# EAGLE schematic Respeaker Microphone Array v1.0 (EAGLE 7.3.0)
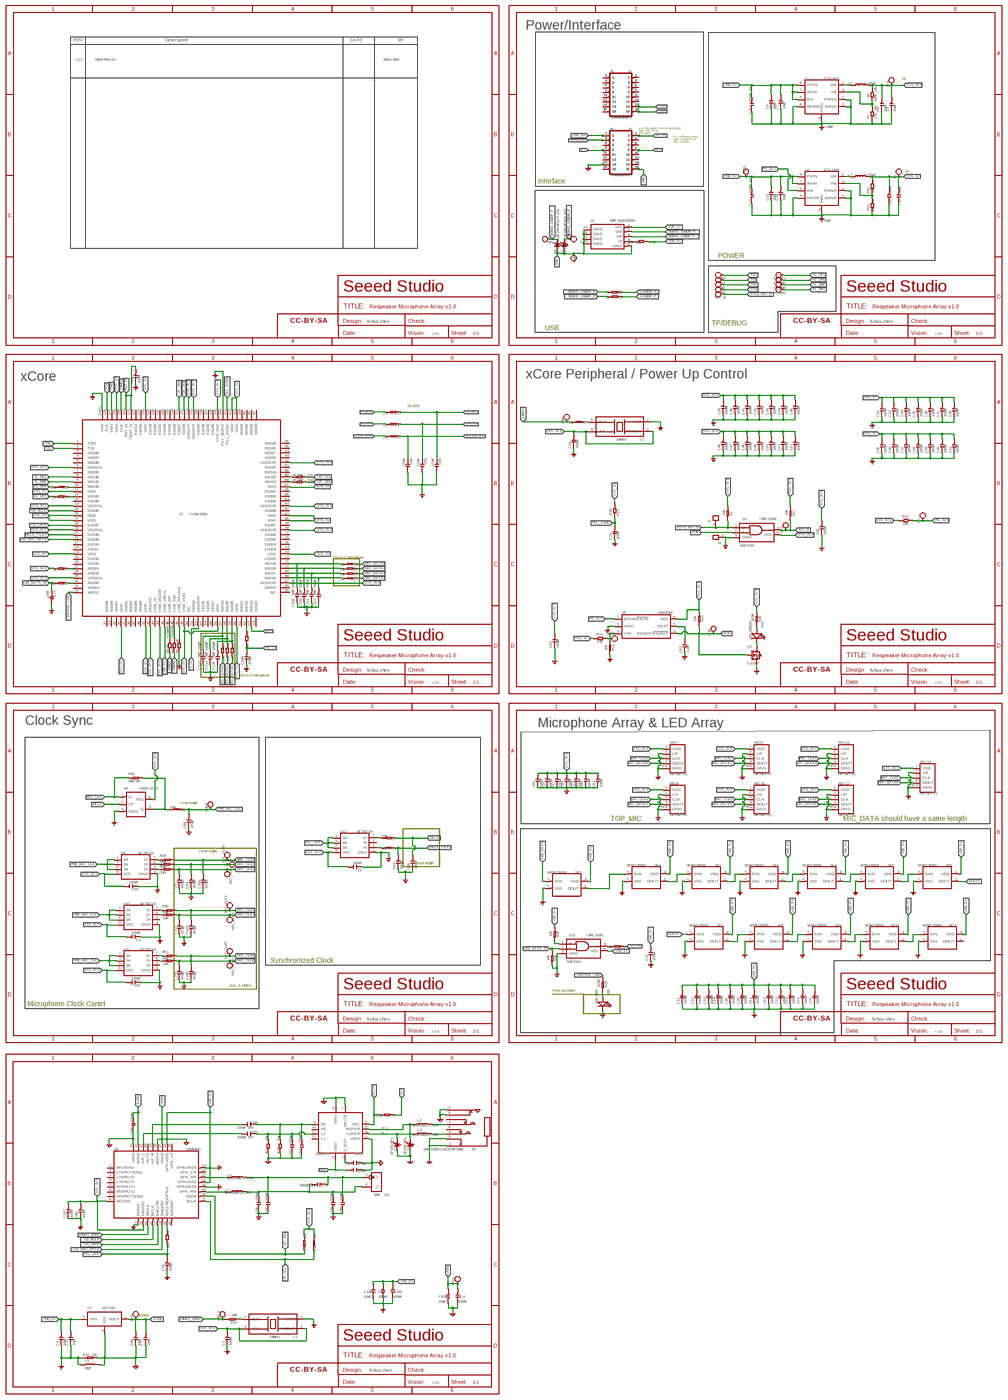
[diagram p0: schematic, sheet 1, overview]
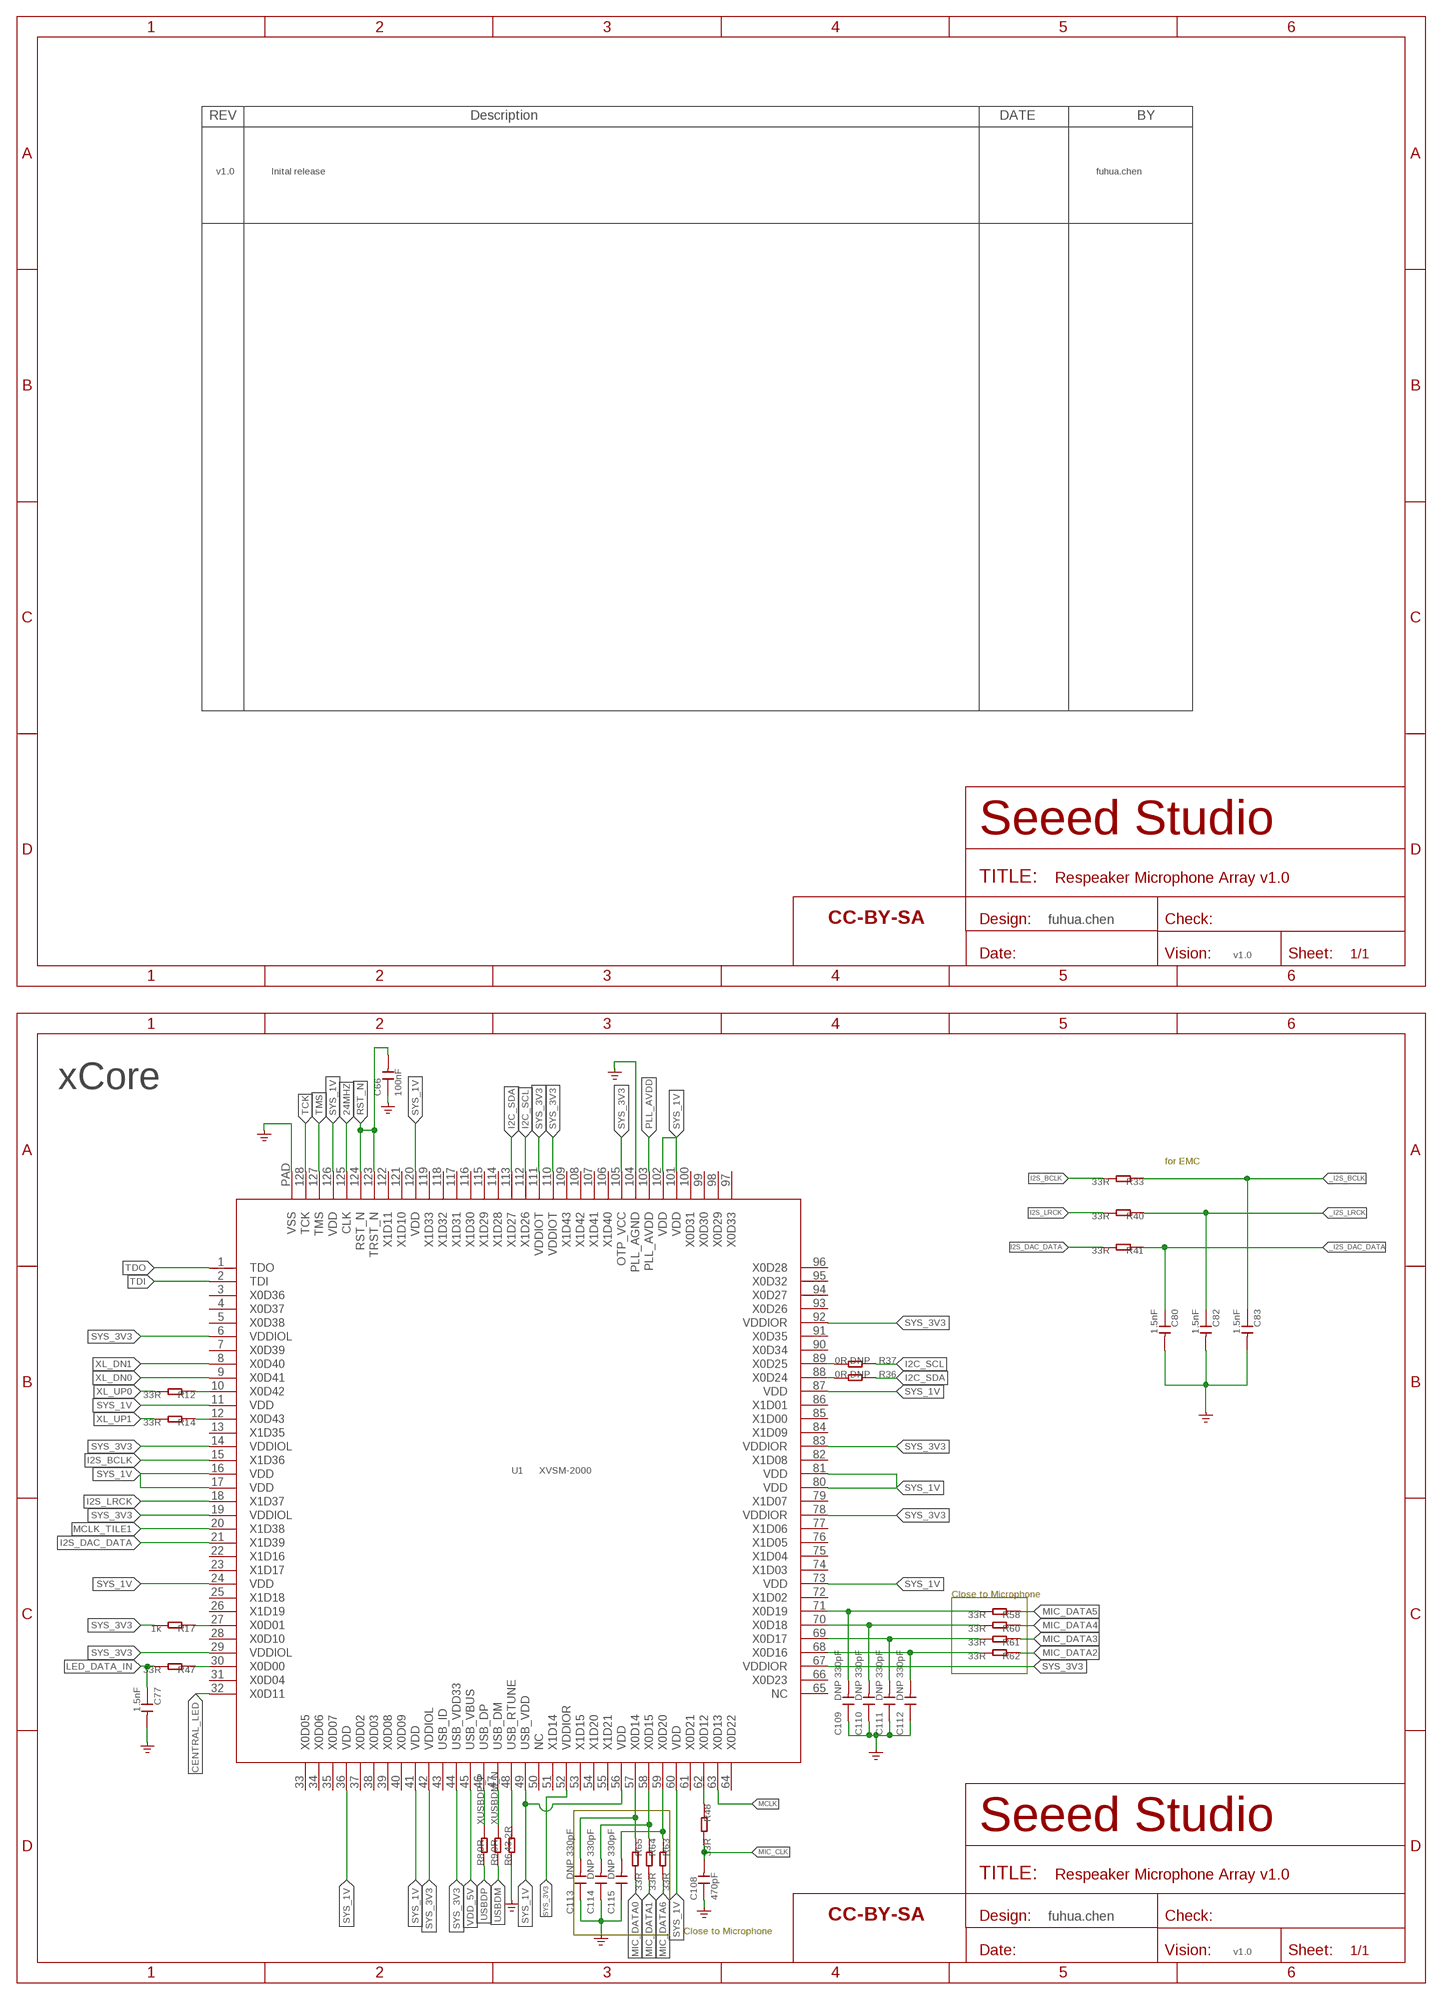
[diagram p1: schematic, sheet 1, part 1 of 4]
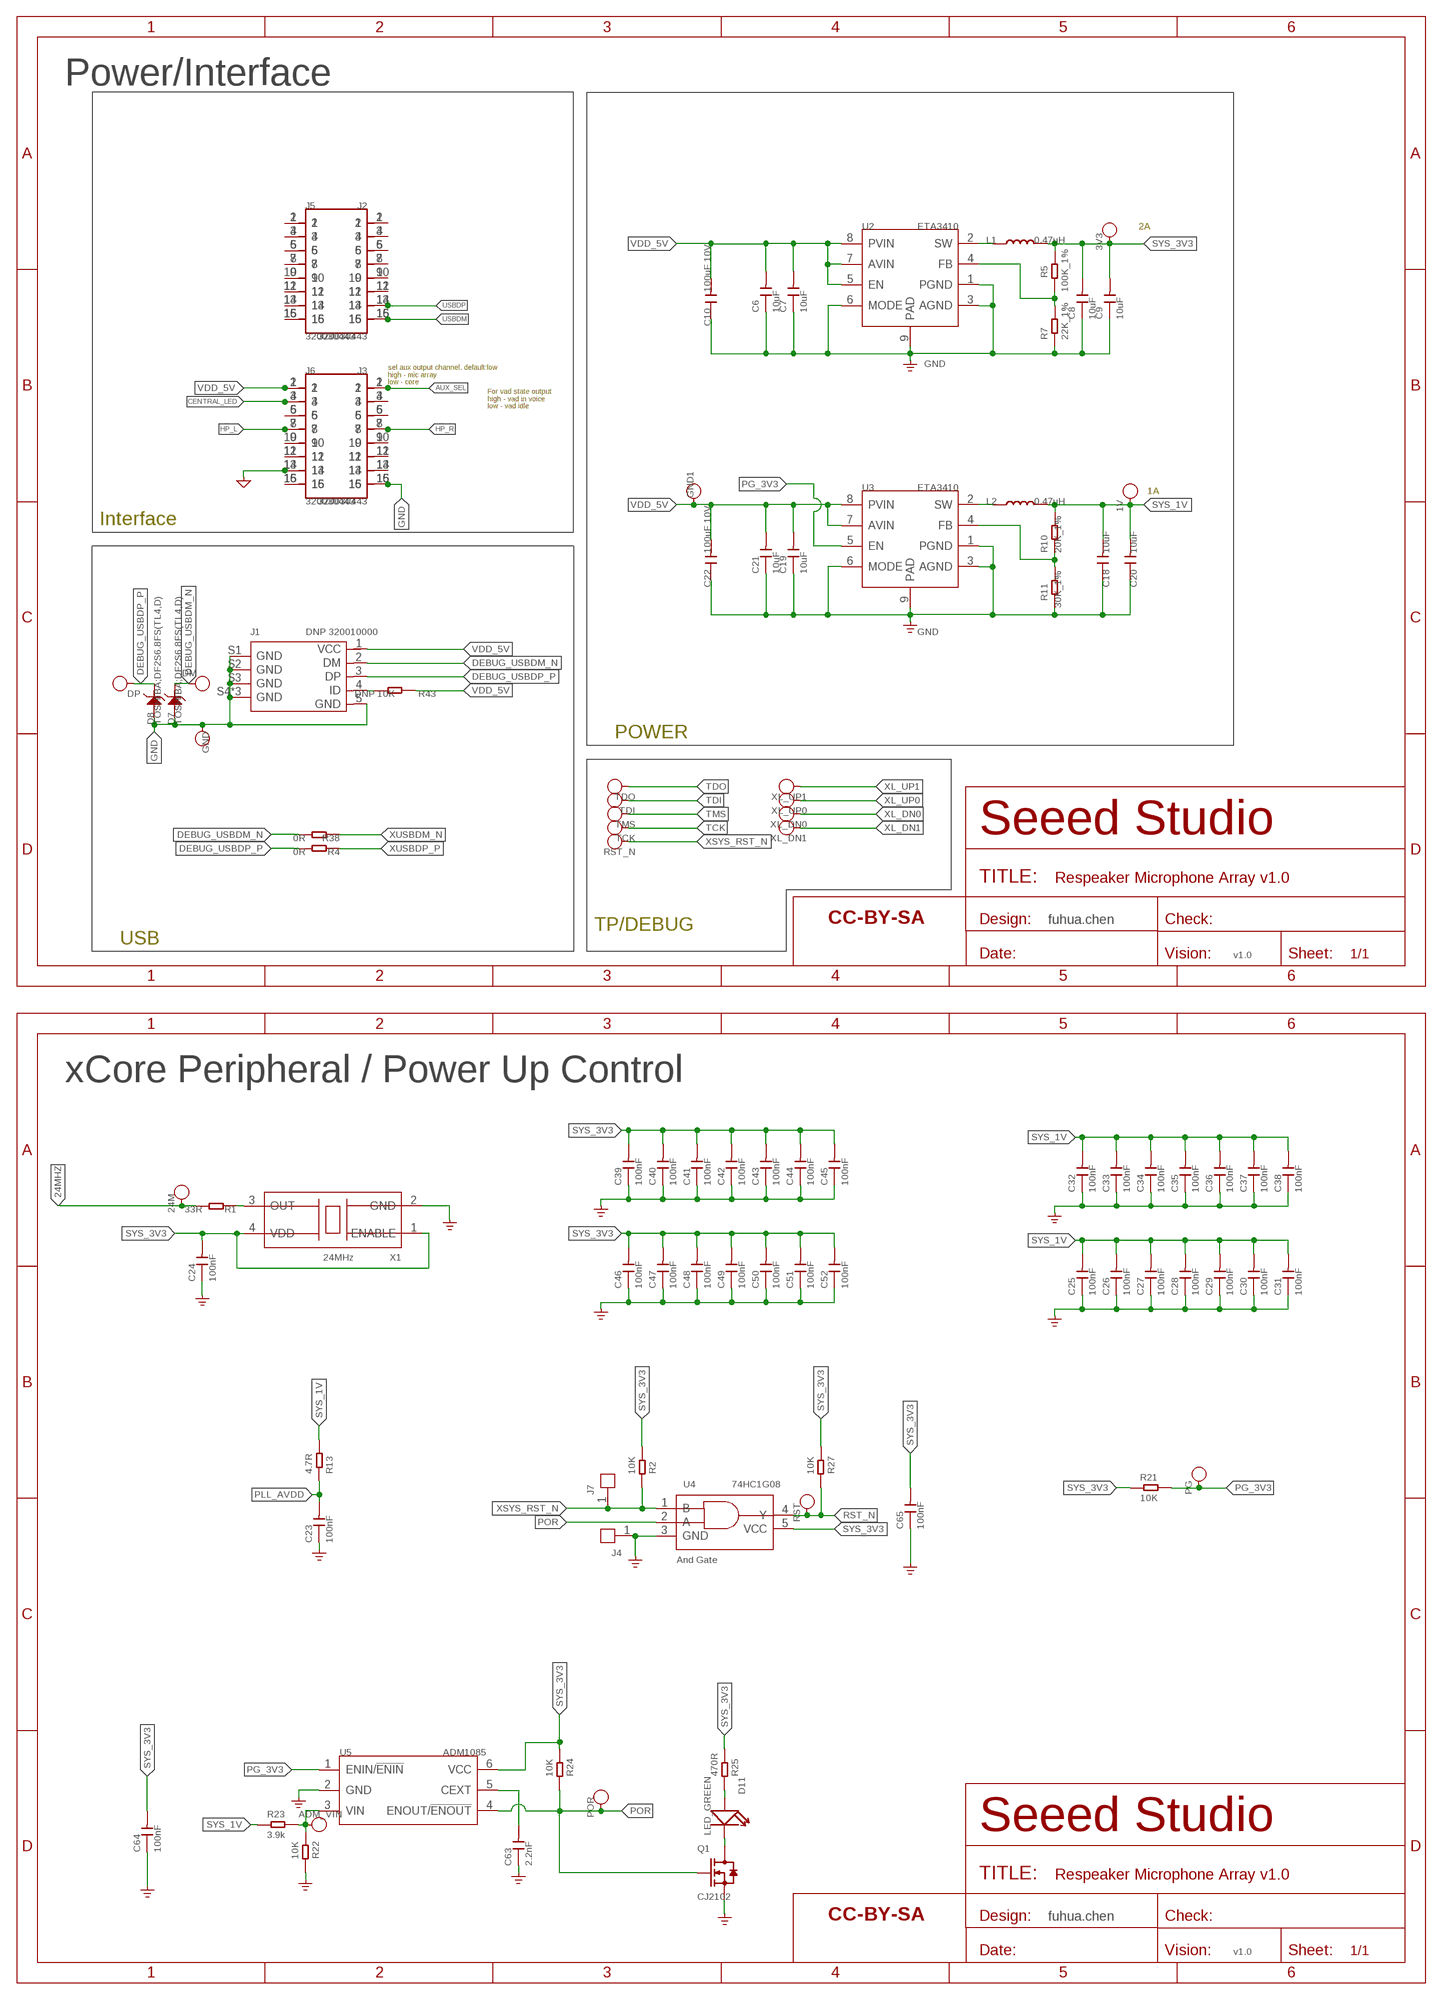
[diagram p2: schematic, sheet 1, part 2 of 4]
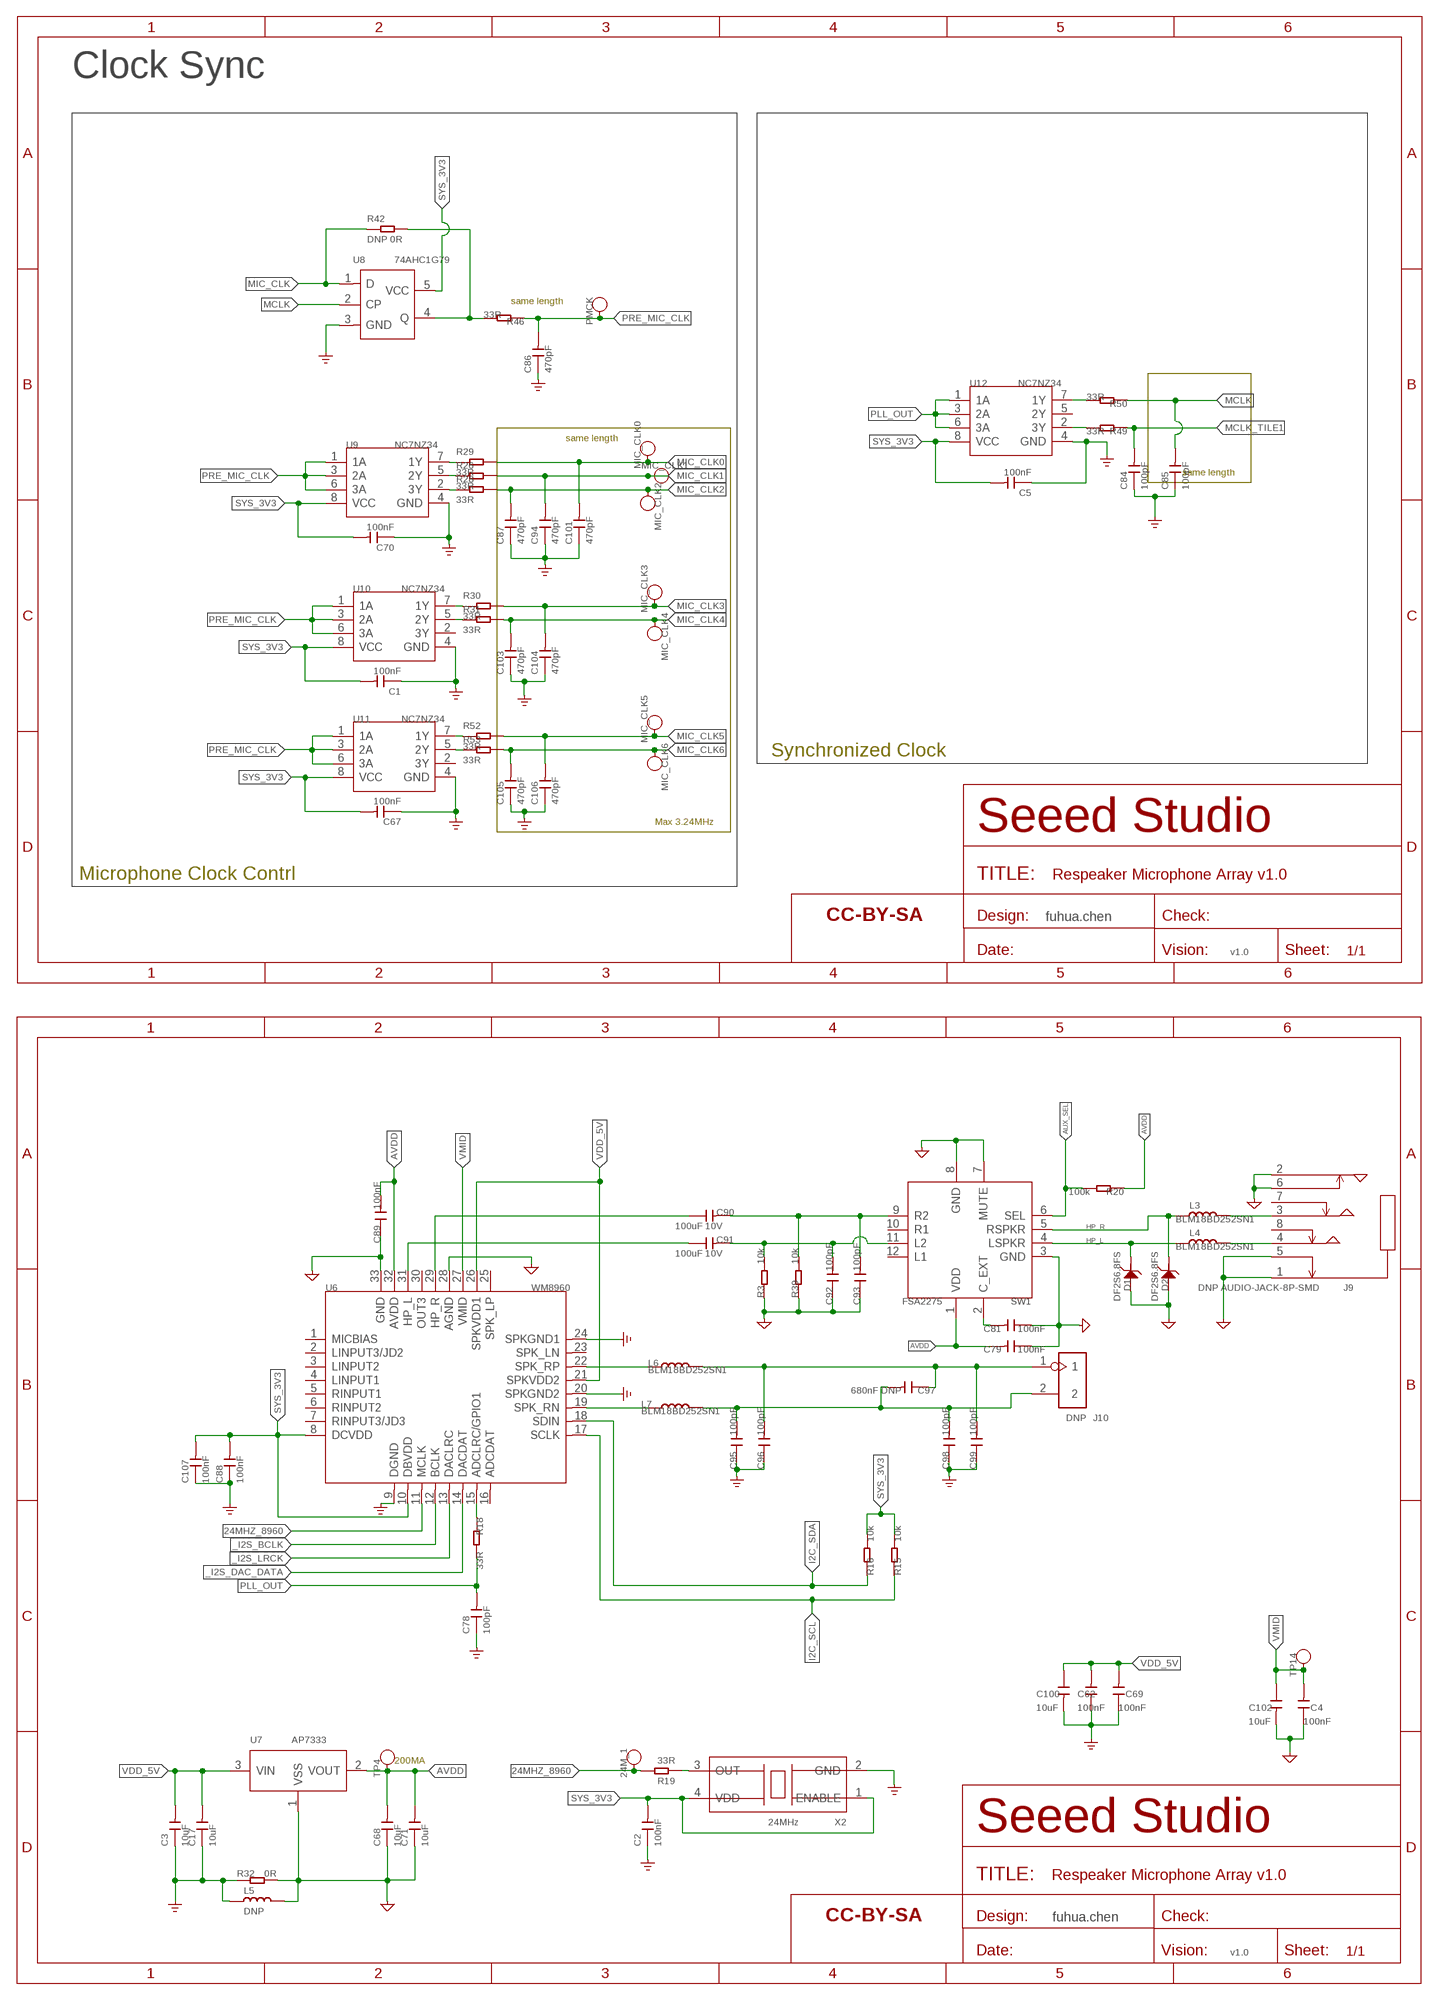
[diagram p3: schematic, sheet 1, part 3 of 4]
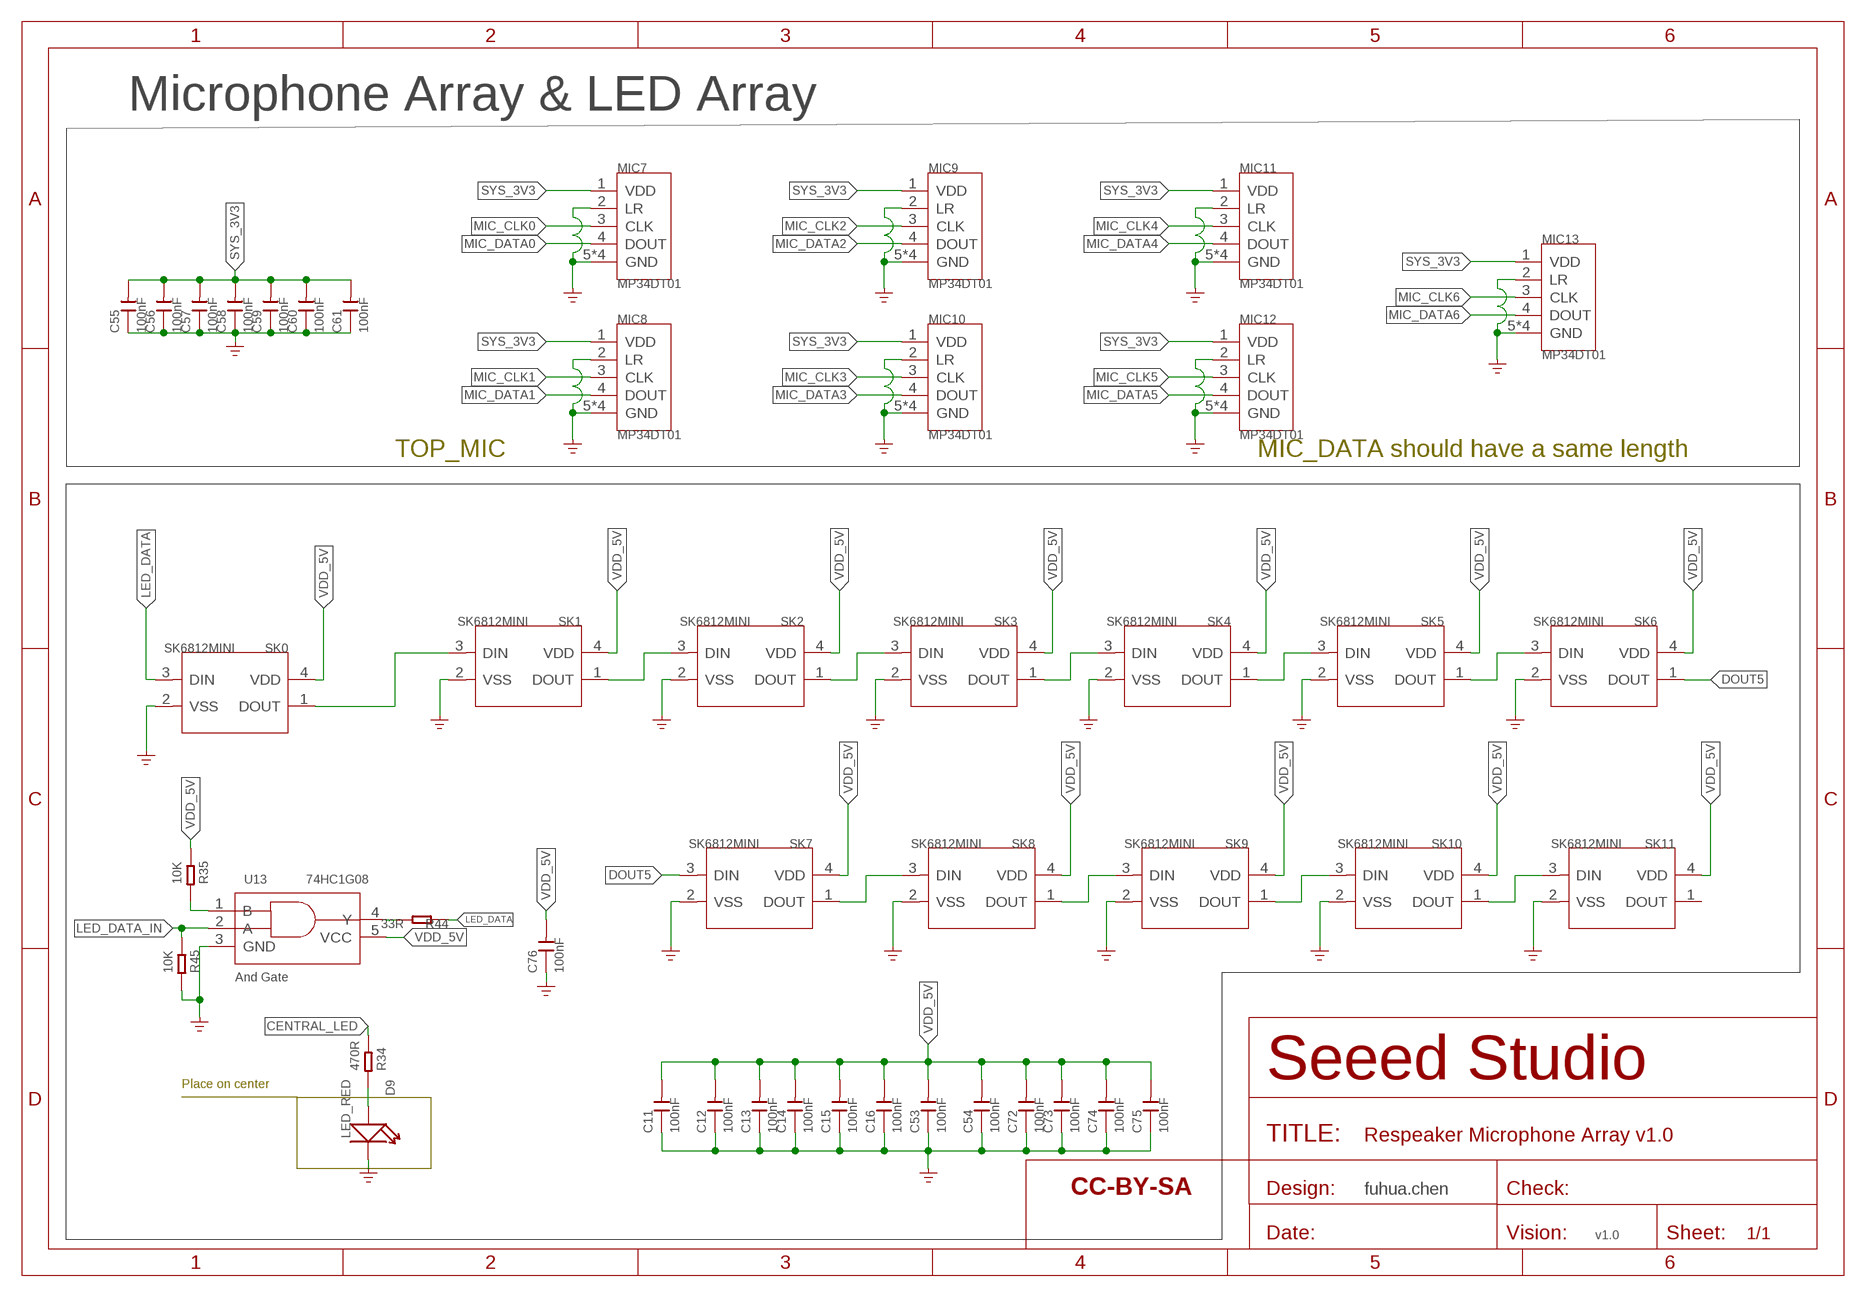
[diagram p4: schematic, sheet 1, part 4 of 4]

## Parts
1V  TEST-POINT'4545'  [TP-D45MIL]
3V3  TEST-POINT'4545'  [TP-D45MIL]
24M  TEST-POINT'4545'  [TP-D45MIL]
24M_1  TEST-POINT'4545'  [TP-D45MIL]
ADM_VIN  TEST-POINT'4545'  [TP-D45MIL]
C1  100nF  CAP-0402  [C0402]
C2  100nF  CAP-0402  [C0402]
C3  10uF  CAP-0603  [C0603]
C4  100nF  CAP-0402  [C0402]
C5  100nF  CAP-0402  [C0402]
C6  10uF  CAP-0603  [C0603]
C7  10uF  CAP-0603  [C0603]
C8  10uF  CAP-0603  [C0603]
C9  10uF  CAP-0603  [C0603]
C10  100uF 10V  CAP-1206  [C1206]
C11  100nF  CAP-0402  [C0402]
C12  100nF  CAP-0402  [C0402]
C13  100nF  CAP-0402  [C0402]
C14  100nF  CAP-0402  [C0402]
C15  100nF  CAP-0402  [C0402]
C16  100nF  CAP-0402  [C0402]
C17  10uF  CAP-0603  [C0603]
C18  10uF  CAP-0603  [C0603]
C19  10uF  CAP-0603  [C0603]
C20  10uF  CAP-0603  [C0603]
C21  10uF  CAP-0603  [C0603]
C22  100uF 10V  CAP-1206  [C1206]
C23  100nF  CAP-0402  [C0402]
C24  100nF  CAP-0402  [C0402]
C25  100nF  CAP-0402  [C0402]
C26  100nF  CAP-0402  [C0402]
C27  100nF  CAP-0402  [C0402]
C28  100nF  CAP-0402  [C0402]
C29  100nF  CAP-0402  [C0402]
C30  100nF  CAP-0402  [C0402]
C31  100nF  CAP-0402  [C0402]
C32  100nF  CAP-0402  [C0402]
C33  100nF  CAP-0402  [C0402]
C34  100nF  CAP-0402  [C0402]
C35  100nF  CAP-0402  [C0402]
C36  100nF  CAP-0402  [C0402]
C37  100nF  CAP-0402  [C0402]
C38  100nF  CAP-0402  [C0402]
C39  100nF  CAP-0402  [C0402]
C40  100nF  CAP-0402  [C0402]
C41  100nF  CAP-0402  [C0402]
C42  100nF  CAP-0402  [C0402]
C43  100nF  CAP-0402  [C0402]
C44  100nF  CAP-0402  [C0402]
C45  100nF  CAP-0402  [C0402]
C46  100nF  CAP-0402  [C0402]
C47  100nF  CAP-0402  [C0402]
C48  100nF  CAP-0402  [C0402]
C49  100nF  CAP-0402  [C0402]
C50  100nF  CAP-0402  [C0402]
C51  100nF  CAP-0402  [C0402]
C52  100nF  CAP-0402  [C0402]
C53  100nF  CAP-0402  [C0402]
C54  100nF  CAP-0402  [C0402]
C55  100nF  CAP-0402  [C0402]
C56  100nF  CAP-0402  [C0402]
C57  100nF  CAP-0402  [C0402]
C58  100nF  CAP-0402  [C0402]
C59  100nF  CAP-0402  [C0402]
C60  100nF  CAP-0402  [C0402]
C61  100nF  CAP-0402  [C0402]
C62  100nF  CAP-0402  [C0402]
C63  2.2nF  CAP-0402  [C0402]
C64  100nF  CAP-0402  [C0402]
C65  100nF  CAP-0402  [C0402]
C66  100nF  CAP-0402  [C0402]
C67  100nF  CAP-0402  [C0402]
C68  10uF  CAP-0603  [C0603]
C69  100nF  CAP-0402  [C0402]
C70  100nF  CAP-0402  [C0402]
C71  10uF  CAP-0603  [C0603]
C72  100nF  CAP-0402  [C0402]
C73  100nF  CAP-0402  [C0402]
C74  100nF  CAP-0402  [C0402]
C75  100nF  CAP-0402  [C0402]
C76  100nF  CAP-0402  [C0402]
C77  1.5nF  CAP-0402  [C0402]
C78  100pF  CAP-0402  [C0402]
C79  100nF  CAP-0402  [C0402]
C80  1.5nF  CAP-0402  [C0402]
C81  100nF  CAP-0402  [C0402]
C82  1.5nF  CAP-0402  [C0402]
C83  1.5nF  CAP-0402  [C0402]
C84  100pF  CAP-0402  [C0402]
C85  100pF  CAP-0402  [C0402]
C86  470pF  CAP-0402  [C0402]
C87  470pF  CAP-0402  [C0402]
C88  100nF  CAP-0402  [C0402]
C89  100nF  CAP-0402  [C0402]
C90  100uF 10V  CAP-1206  [C1206]
C91  100uF 10V  CAP-1206  [C1206]
C92  100pF  CAP-0402  [C0402]
C93  100pF  CAP-0402  [C0402]
C94  470pF  CAP-0402  [C0402]
C95  100pF  CAP-0402  [C0402]
C96  100pF  CAP-0402  [C0402]
C97  680nF DNP  CAP-0402  [C0402]
C98  100pF  CAP-0402  [C0402]
C99  100pF  CAP-0402  [C0402]
C100  10uF  CAP-0603  [C0603]
C101  470pF  CAP-0402  [C0402]
C102  10uF  CAP-0603  [C0603]
C103  470pF  CAP-0402  [C0402]
C104  470pF  CAP-0402  [C0402]
C105  470pF  CAP-0402  [C0402]
C106  470pF  CAP-0402  [C0402]
C107  100nF  CAP-0402  [C0402]
C108  470pF  CAP-0402  [C0402]
C109  DNP 330pF  CAP-0402  [C0402]
C110  DNP 330pF  CAP-0402  [C0402]
C111  DNP 330pF  CAP-0402  [C0402]
C112  DNP 330pF  CAP-0402  [C0402]
C113  DNP 330pF  CAP-0402  [C0402]
C114  DNP 330pF  CAP-0402  [C0402]
C115  DNP 330pF  CAP-0402  [C0402]
D1  DF2S6.8FS  D-ESD-2P'DF2S6.8FS'  [SOD-923]
D2  DF2S6.8FS  D-ESD-2P'DF2S6.8FS'  [SOD-923]
D7  TOSHIBA;DF2S6.8FS(TL4,D)  D-ESD-2P'DF2S6.8FS'  [SOD-923]
D8  TOSHIBA;DF2S6.8FS(TL4,D)  D-ESD-2P'DF2S6.8FS'  [SOD-923]
D9  LED_RED  LED-0402  [LED-0402]
D11  LED_GREEN  LED-0402  [LED-0402]
DM  TEST-POINT'4545'  [TP-D45MIL]
DP  TEST-POINT'4545'  [TP-D45MIL]
FR1  SEEEDSTUDIO-OPEN-SCH-FRAME  [SEEEDSTUDIO-PCB-FRAME]
FR2  SEEEDSTUDIO-OPEN-SCH-FRAME  [SEEEDSTUDIO-PCB-FRAME]
FR3  SEEEDSTUDIO-OPEN-SCH-FRAME  [SEEEDSTUDIO-PCB-FRAME]
FR4  SEEEDSTUDIO-OPEN-SCH-FRAME  [SEEEDSTUDIO-PCB-FRAME]
FR5  SEEEDSTUDIO-OPEN-SCH-FRAME  [SEEEDSTUDIO-PCB-FRAME]
FR7  SEEEDSTUDIO-OPEN-SCH-FRAME  [SEEEDSTUDIO-PCB-FRAME]
FR8  SEEEDSTUDIO-OPEN-SCH-FRAME  [SEEEDSTUDIO-PCB-FRAME]
GND  TEST-POINT'4545'  [TP-D45MIL]
GND1  TEST-POINT'4545'  [TP-D45MIL]
J1  DNP 320010000  MICRO-USB5+4P'5+4P'  [MICRO-USB5+4P-SMD-0.65-B]
J2  320030443  HEADER-2X8P-SMD-2.0  [H2X8-SMD-2.0]
J3  320030443  HEADER-2X8P-SMD-2.0  [H2X8-SMD-2.0]
J4  HEADER-1P'20'  [1P-40/25MIL]
J5  320030443  HEADER-2X8P-SMD-2.0  [H2X8-SMD-2.0]
J6  320030443  HEADER-2X8P-SMD-2.0  [H2X8-SMD-2.0]
J7  HEADER-1P'20'  [1P-40/25MIL]
J9  DNP AUDIO-JACK-8P-SMD  AUDIO-JACK-8P-SMD'PJ-393'  [AUDIO8P-SMD-3.5-14.5X6.1X4.0MM]
J10  DNP  HEADER-2P-65/35MIL  [H2-2.54]
L1  0.47uH  L-MPM201610SR33_T  [L201610]
L2  0.47uH  L-MPM201610SR33_T  [L201610]
L3  BLM18BD252SN1  INDUCTOR/FERRITE-BEAD'0603'  [L0603]
L4  BLM18BD252SN1  INDUCTOR/FERRITE-BEAD'0603'  [L0603]
L5  DNP  INDUCTOR/FERRITE-BEAD'0603'  [L0603]
L6  BLM18BD252SN1  INDUCTOR/FERRITE-BEAD'0603'  [L0603]
L7  BLM18BD252SN1  INDUCTOR/FERRITE-BEAD'0603'  [L0603]
MIC7  MP34DT01  MICROPHONE-MP34DT01  [HCLGA5P-3X4X1MM]
MIC8  MP34DT01  MICROPHONE-MP34DT01  [HCLGA5P-3X4X1MM]
MIC9  MP34DT01  MICROPHONE-MP34DT01  [HCLGA5P-3X4X1MM]
MIC10  MP34DT01  MICROPHONE-MP34DT01  [HCLGA5P-3X4X1MM]
MIC11  MP34DT01  MICROPHONE-MP34DT01  [HCLGA5P-3X4X1MM]
MIC12  MP34DT01  MICROPHONE-MP34DT01  [HCLGA5P-3X4X1MM]
MIC13  MP34DT01  MICROPHONE-MP34DT01  [HCLGA5P-3X4X1MM]
MIC_CLK0  TEST-POINT'4545'  [TP-D45MIL]
MIC_CLK1  TEST-POINT'4545'  [TP-D45MIL]
MIC_CLK2  TEST-POINT'4545'  [TP-D45MIL]
MIC_CLK3  TEST-POINT'4545'  [TP-D45MIL]
MIC_CLK4  TEST-POINT'4545'  [TP-D45MIL]
MIC_CLK5  TEST-POINT'4545'  [TP-D45MIL]
MIC_CLK6  TEST-POINT'4545'  [TP-D45MIL]
PG  TEST-POINT'4545'  [TP-D45MIL]
PMCK  TEST-POINT'4545'  [TP-D45MIL]
POR  TEST-POINT'4545'  [TP-D45MIL]
Q1  CJ2102  MOSFET-N+'SI1304BDL'  [SOT-323]
R1  33R  RES-0402  [R0402]
R2  10K  RES-0402  [R0402]
R3  10k  RES-0402  [R0402]
R4  0R  RES-0402  [R0402]
R5  100K_1%  RES-0402  [R0402]
R6  43.2R  RES-0402  [R0402]
R7  22K_1%  RES-0402  [R0402]
R8  0R  RES-0402  [R0402]
R9  0R  RES-0402  [R0402]
R10  20K_1%  RES-0402  [R0402]
R11  30K_1%  RES-0402  [R0402]
R12  33R  RES-0402  [R0402]
R13  4.7R  RES-0805  [R0805]
R14  33R  RES-0402  [R0402]
R15  10k  RES-0402  [R0402]
R16  10k  RES-0402  [R0402]
R17  1k  RES-0402  [R0402]
R18  33R  RES-0402  [R0402]
R19  33R  RES-0402  [R0402]
R20  100k  RES-0402  [R0402]
R21  10K  RES-0402  [R0402]
R22  10K  RES-0402  [R0402]
R23  3.9k  RES-0402  [R0402]
R24  10K  RES-0402  [R0402]
R25  470R  RES-0402  [R0402]
R26  33R  RES-0402  [R0402]
R27  10K  RES-0402  [R0402]
R28  33R  RES-0402  [R0402]
R29  33R  RES-0402  [R0402]
R30  33R  RES-0402  [R0402]
R31  33R  RES-0402  [R0402]
R32  0R  RES-0402  [R0402]
R33  33R  RES-0402  [R0402]
R34  470R  RES-0402  [R0402]
R35  10K  RES-0402  [R0402]
R36  0R DNP  RES-0402  [R0402]
R37  0R DNP  RES-0402  [R0402]
R38  0R  RES-0402  [R0402]
R39  10k  RES-0402  [R0402]
R40  33R  RES-0402  [R0402]
R41  33R  RES-0402  [R0402]
R42  DNP 0R  RES-0402  [R0402]
R43  DNP 10K  RES-0402  [R0402]
R44  33R  RES-0402  [R0402]
R45  10K  RES-0402  [R0402]
R46  33R  RES-0402  [R0402]
R47  33R  RES-0402  [R0402]
R48  33R  RES-0402  [R0402]
R49  33R  RES-0402  [R0402]
R50  33R  RES-0402  [R0402]
R52  33R  RES-0402  [R0402]
R53  33R  RES-0402  [R0402]
R58  33R  RES-0402  [R0402]
R60  33R  RES-0402  [R0402]
R61  33R  RES-0402  [R0402]
R62  33R  RES-0402  [R0402]
R63  33R  RES-0402  [R0402]
R64  33R  RES-0402  [R0402]
R65  33R  RES-0402  [R0402]
RST  TEST-POINT'4545'  [TP-D45MIL]
RST_N  TEST-POINT'4545'  [TP-D45MIL]
SK0  SK6812MINI  LED-RGB-4P-SK68122  [LED4-SMD-3.5X3.7MM]
SK1  SK6812MINI  LED-RGB-4P-SK68122  [LED4-SMD-3.5X3.7MM]
SK2  SK6812MINI  LED-RGB-4P-SK68122  [LED4-SMD-3.5X3.7MM]
SK3  SK6812MINI  LED-RGB-4P-SK68122  [LED4-SMD-3.5X3.7MM]
SK4  SK6812MINI  LED-RGB-4P-SK68122  [LED4-SMD-3.5X3.7MM]
SK5  SK6812MINI  LED-RGB-4P-SK68122  [LED4-SMD-3.5X3.7MM]
SK6  SK6812MINI  LED-RGB-4P-SK68122  [LED4-SMD-3.5X3.7MM]
SK7  SK6812MINI  LED-RGB-4P-SK68122  [LED4-SMD-3.5X3.7MM]
SK8  SK6812MINI  LED-RGB-4P-SK68122  [LED4-SMD-3.5X3.7MM]
SK9  SK6812MINI  LED-RGB-4P-SK68122  [LED4-SMD-3.5X3.7MM]
SK10  SK6812MINI  LED-RGB-4P-SK68122  [LED4-SMD-3.5X3.7MM]
SK11  SK6812MINI  LED-RGB-4P-SK68122  [LED4-SMD-3.5X3.7MM]
SW1  FSA2275  SWITCH-ANALOG-FSA2275  [LEAD12P-SMD-0.4-1.8X1.8X0.5MM]
TCK  TEST-POINT'4545'  [TP-D45MIL]
TDI  TEST-POINT'4545'  [TP-D45MIL]
TDO  TEST-POINT'4545'  [TP-D45MIL]
TMS  TEST-POINT'4545'  [TP-D45MIL]
TP4  TEST-POINT'4545'  [TP-D45MIL]
TP14  TEST-POINT'4545'  [TP-D45MIL]
U1  XVSM-2000  MCU-XUF216-512-TQ128  [TQFP128-0.4-14X14MM]
U2  ETA3410  CONVERTER-ETA3410  [DFN8G-0.5-2X2MM]
U3  ETA3410  CONVERTER-ETA3410  [DFN8G-0.5-2X2MM]
U4  74HC1G08  LOGIC-74HC1G08'GW'  [SOT-353]
U5  ADM1085  ANALOG-DEVICE-ADM1085  [SC-70-6]
U6  WM8960  AMPLIFIER-WM8960  [QFN32G-0.5-5X5MM]
U7  AP7333  PMIC-XC6206PMR  [SOT-23]
U8  74AHC1G79  LOGIC-74AHC/T1G79  [SOT-353]
U9  NC7NZ34  LOGIC-NC7NZ34  [US-8]
U10  NC7NZ34  LOGIC-NC7NZ34  [US-8]
U11  NC7NZ34  LOGIC-NC7NZ34  [US-8]
U12  NC7NZ34  LOGIC-NC7NZ34  [US-8]
U13  74HC1G08  LOGIC-74HC1G08'GW'  [SOT-353]
X1  24MHz  CRYSTAL-OSCILLATOR-NZ2520  [OSC-SMD-2.5X2.0X0.9MM]
X2  24MHz  CRYSTAL-OSCILLATOR-NZ2520  [OSC-SMD-2.5X2.0X0.9MM]
XL_DN0  TEST-POINT'4545'  [TP-D45MIL]
XL_DN1  TEST-POINT'4545'  [TP-D45MIL]
XL_UP0  TEST-POINT'4545'  [TP-D45MIL]
XL_UP1  TEST-POINT'4545'  [TP-D45MIL]

## Nets
24MHZ: 24M.T R1.2 U1.125(CLK)
24MHZ_8960: 24M_1.T R19.2 U6.11(MCLK)
$123: C90.1 U6.29(HP_R)
$124: C91.1 U6.31(HP_L)
_I2S_BCLK: C83.1 R33.1 U6.12(BCLK)
_I2S_DAC_DATA: C80.1 R41.1 U6.14(DACDAT)
_I2S_LRCK: C82.1 R40.1 U6.13(DACLRC)
AGND: C4.1 C68.1 C71.1 C79.1 C81.1 C89.1 C92.1 C93.1 C102.2 D1.2 D2.2 J3.14 J6.13 J9.1 J9.2 J9.5 J9.6 L5.2 R3.1 R32.2 R39.1 SW1.3(GND) SW1.7(MUTE) SW1.8(GND) U6.28(AGND) U6.33(GND) U7.1(VSS) ; supply symbol labelled GND_SIGNAL
AUX_SEL: J3.1 J6.2 R20.2 SW1.6(SEL)
AVDD: C68.2 C71.2 C79.2 C89.2 R20.1 SW1.1(VDD) TP4.T U6.32(AVDD) U7.2(VOUT)
CENTRAL_LED: J3.4 J6.3 R34.2 U1.32(X0D11)
DEBUG_USBDM_N: D7.1 DM.T J1.2(DM) R38.2
DEBUG_USBDP_P: D8.1 DP.T J1.3(DP) R4.2
DOUT5: SK6.1(DOUT) SK7.3(DIN)
GND: C1.1 C2.1 C3.1 C5.1 C6.1 C7.1 C8.1 C9.1 C10.1 C11.1 C12.1 C13.1 C14.1 C15.1 C16.1 C17.1 C18.1 C19.1 C20.1 C21.1 C22.1 C23.1 C24.1 C25.1 C26.1 C27.1 C28.1 C29.1 C30.1 C31.1 C32.1 C33.1 C34.1 C35.1 C36.1 C37.1 C38.1 C39.1 C40.1 C41.1 C42.1 C43.1 C44.1 C45.1 C46.1 C47.1 C48.1 C49.1 C50.1 C51.1 C52.1 C53.1 C54.1 C55.1 C56.1 C57.1 C58.1 C59.1 C60.1 C61.1 C62.1 C63.1 C64.1 C65.1 C66.1 C67.1 C69.1 C70.1 C72.1 C73.1 C74.1 C75.1 C76.1 C77.2 C78.1 C80.2 C82.2 C83.2 C84.1 C85.1 C86.1 C87.1 C88.1 C94.1 C95.1 C96.1 C98.1 C99.1 C100.2 C101.1 C103.1 C104.1 C105.1 C106.1 C107.1 C108.1 C109.1 C110.1 C111.1 C112.1 C113.1 C114.1 C115.1 D7.2 D8.2 D9.- GND.T J1.5(GND) J1.S1(GND) J1.S2(GND) J1.S3(GND) J1.S4(GND) J1.S5(GND) J1.S6(GND) J3.15 J4.1 J6.16 L5.1 MIC7.2(LR) MIC7.5(GND) MIC7.6(GND) MIC7.7(GND) MIC7.8(GND) MIC8.2(LR) MIC8.5(GND) MIC8.6(GND) MIC8.7(GND) MIC8.8(GND) MIC9.2(LR) MIC9.5(GND) MIC9.6(GND) MIC9.7(GND) MIC9.8(GND) MIC10.2(LR) MIC10.5(GND) MIC10.6(GND) MIC10.7(GND) MIC10.8(GND) MIC11.2(LR) MIC11.5(GND) MIC11.6(GND) MIC11.7(GND) MIC11.8(GND) MIC12.2(LR) MIC12.5(GND) MIC12.6(GND) MIC12.7(GND) MIC12.8(GND) MIC13.2(LR) MIC13.5(GND) MIC13.6(GND) MIC13.7(GND) MIC13.8(GND) Q1.2(S) R6.1 R7.1 R11.1 R22.1 R32.1 R45.1 SK0.2(VSS) SK1.2(VSS) SK2.2(VSS) SK3.2(VSS) SK4.2(VSS) SK5.2(VSS) SK6.2(VSS) SK7.2(VSS) SK8.2(VSS) SK9.2(VSS) SK10.2(VSS) SK11.2(VSS) U1.104(PLL_AGND) U1.PAD(VSS) U2.1(PGND) U2.3(AGND) U2.6(MODE) U2.9(PAD) U3.1(PGND) U3.3(AGND) U3.6(MODE) U3.9(PAD) U4.3(GND) U5.2(GND) U6.9(DGND) U6.20(SPKGND2) U6.24(SPKGND1) U8.3(GND) U9.4(GND) U10.4(GND) U11.4(GND) U12.4(GND) U13.3(GND) X1.2(GND) X2.2(GND) ; supply symbol labelled GND_POWER
HP_L: D1.1 J3.8 J6.7 L4.1 SW1.4(LSPKR)
HP_R: D2.1 J3.7 J6.8 L3.1 SW1.5(RSPKR)
I2C_SCL: R15.1 R37.1 U1.112(X1D26) U6.17(SCLK)
I2C_SDA: R16.1 R36.1 U1.113(X1D27) U6.18(SDIN)
I2S_BCLK: R33.2 U1.15(X1D36)
I2S_DAC_DATA: R41.2 U1.21(X1D39)
I2S_LRCK: R40.2 U1.18(X1D37)
LED_DATA: R44.1 SK0.3(DIN)
LED_DATA_IN: C77.1 R45.2 R47.2 U13.2(A)
MCLK: C85.2 R50.1 U1.63(X0D13) U8.2(CP)
MCLK_TILE1: C84.2 R49.1 U1.20(X1D38)
MIC_CLK: C108.2 R42.1 R48.2 U8.1(D)
MIC_CLK0: C101.2 MIC7.3(CLK) MIC_CLK0.T R29.2
MIC_CLK1: C94.2 MIC8.3(CLK) MIC_CLK1.T R26.2
MIC_CLK2: C87.2 MIC9.3(CLK) MIC_CLK2.T R28.2
MIC_CLK3: C104.2 MIC10.3(CLK) MIC_CLK3.T R30.2
MIC_CLK4: C103.2 MIC11.3(CLK) MIC_CLK4.T R31.2
MIC_CLK5: C106.2 MIC12.3(CLK) MIC_CLK5.T R52.2
MIC_CLK6: C105.2 MIC13.3(CLK) MIC_CLK6.T R53.2
MIC_DATA0: MIC7.4(DOUT) R65.2
MIC_DATA1: MIC8.4(DOUT) R64.2
MIC_DATA2: MIC9.4(DOUT) R62.1
MIC_DATA3: MIC10.4(DOUT) R61.1
MIC_DATA4: MIC11.4(DOUT) R60.1
MIC_DATA5: MIC12.4(DOUT) R58.1
MIC_DATA6: MIC13.4(DOUT) R63.2
N$1: R14.1 U1.12(X0D43)
N$2: R18.1 U6.15(ADCLRC/GPIO1)
N$3: L2.1 U3.2(SW)
N$4: R6.2 U1.48(USB_RTUNE)
N$5: R12.1 U1.10(X0D42)
N$6: R17.1 U1.27(X0D01)
N$7: ADM_VIN.T R22.2 R23.1 U5.3(VIN)
N$8: R10.1 R11.2 U3.4(FB)
N$9: D11.- Q1.3(D)
N$10: SK8.1(DOUT) SK9.3(DIN)
N$11: R1.1 X1.3(OUT)
N$12: D11.+ R25.1
N$13: SK1.1(DOUT) SK2.3(DIN)
N$14: C63.2 U5.5(CEXT)
N$15: R28.1 U9.2(3Y)
N$16: R53.1 U11.5(2Y)
N$17: SK2.1(DOUT) SK3.3(DIN)
N$18: C81.2 SW1.2(C_EXT)
N$19: SK3.1(DOUT) SK4.3(DIN)
N$20: SK4.1(DOUT) SK5.3(DIN)
N$21: R19.1 X2.3(OUT)
N$22: R26.1 U9.5(2Y)
N$23: R31.1 U10.5(2Y)
N$24: R29.1 U9.7(1Y)
N$25: R49.2 U12.2(3Y)
N$26: R50.2 U12.7(1Y)
N$27: J2.1 J5.2
N$28: R30.1 U10.7(1Y)
N$29: L1.1 U2.2(SW)
N$30: J2.2 J5.1
N$31: R47.1 U1.30(X0D00)
N$32: R5.1 R7.2 U2.4(FB)
N$33: R52.1 U11.7(1Y)
N$34: J2.3 J5.4
N$35: C109.2 R58.2 U1.71(X0D19)
N$36: C110.2 R60.2 U1.70(X0D18)
N$37: C111.2 R61.2 U1.69(X0D17)
N$38: C112.2 R62.2 U1.68(X0D16)
N$40: C115.2 R63.1 U1.59(X0D20)
N$41: C114.2 R64.1 U1.58(X0D15)
N$42: J3.5 J6.6
N$43: J1.4(ID) R43.2
N$44: SK5.1(DOUT) SK6.3(DIN)
N$45: SK7.1(DOUT) SK8.3(DIN)
N$46: R36.2 U1.88(X0D24)
N$47: SK9.1(DOUT) SK10.3(DIN)
N$48: SK10.1(DOUT) SK11.3(DIN)
N$49: SK0.1(DOUT) SK1.3(DIN)
N$50: D9.+ R34.1
N$51: J2.4 J5.3
N$52: J2.5 J5.6
N$53: R37.2 U1.89(X0D25)
N$54: C95.2 C97.2 C98.2 J10.2 L7.2
N$55: J9.3 L3.2
N$56: C90.2 C93.2 R39.2 SW1.9(R2)
N$57: J9.4 L4.2
N$58: J2.6 J5.5
N$59: J2.7 J5.8
N$60: J2.8 J5.7
N$61: C91.2 C92.2 R3.2 SW1.11(L2)
N$62: L6.1 U6.22(SPK_RP)
N$63: J2.9 J5.10
N$64: J2.10 J5.9
N$65: L7.1 U6.19(SPK_RN)
N$66: C96.2 C97.1 C99.2 J10.1 L6.2
N$67: J2.11 J5.12
N$68: J2.12 J5.11
N$69: J2.14 J5.13
N$70: J2.16 J5.15
N$71: R44.2 U13.4(Y)
N$72: R35.1 U13.1(B)
N$73: J3.6 J6.5
N$74: J3.9 J6.10
N$75: J3.10 J6.9
N$76: J3.11 J6.12
N$77: J3.12 J6.11
N$78: J3.13 J6.14
N$79: J3.16 J6.15
N$80: R42.2 R46.2 U8.4(Q)
N$81: R48.1 U1.62(X0D12)
N$82: C113.2 R65.1 U1.57(X0D14)
N$83: J3.3 J6.4
PG_3V3: PG.T R21.1 U3.5(EN) U5.1(ENIN/!ENIN)
PLL_AVDD: C23.2 R13.1 U1.103(PLL_AVDD)
PLL_OUT: C78.2 R18.2 U12.1(1A) U12.3(2A) U12.6(3A)
POR: POR.T Q1.1(G) R24.1 U4.2(A) U5.4(ENOUT/!ENOUT)
PRE_MIC_CLK: C86.2 PMCK.T R46.1 U9.1(1A) U9.3(2A) U9.6(3A) U10.1(1A) U10.3(2A) U10.6(3A) U11.1(1A) U11.3(2A) U11.6(3A)
RST_N: C66.2 R27.1 RST.T U1.123(TRST_N) U1.124(RST_N) U4.4(Y)
SYS_1V: 1V.T C18.2 C20.2 C25.2 C26.2 C27.2 C28.2 C29.2 C30.2 C31.2 C32.2 C33.2 C34.2 C35.2 C36.2 C37.2 C38.2 L2.2 R10.2 R13.2 R23.2 U1.11(VDD) U1.16(VDD) U1.17(VDD) U1.24(VDD) U1.36(VDD) U1.41(VDD) U1.49(USB_VDD) U1.56(VDD) U1.60(VDD) U1.73(VDD) U1.80(VDD) U1.81(VDD) U1.87(VDD) U1.101(VDD) U1.102(VDD) U1.120(VDD) U1.126(VDD)
SYS_3V3: 3V3.T C1.2 C2.2 C5.2 C8.2 C9.2 C24.2 C39.2 C40.2 C41.2 C42.2 C43.2 C44.2 C45.2 C46.2 C47.2 C48.2 C49.2 C50.2 C51.2 C52.2 C55.2 C56.2 C57.2 C58.2 C59.2 C60.2 C61.2 C64.2 C65.2 C67.2 C70.2 C88.2 C107.2 L1.2 MIC7.1(VDD) MIC8.1(VDD) MIC9.1(VDD) MIC10.1(VDD) MIC11.1(VDD) MIC12.1(VDD) MIC13.1(VDD) R2.2 R5.2 R15.2 R16.2 R17.2 R21.2 R24.2 R25.2 R27.2 U1.6(VDDIOL) U1.14(VDDIOL) U1.19(VDDIOL) U1.29(VDDIOL) U1.42(VDDIOL) U1.44(USB_VDD33) U1.52(VDDIOR) U1.67(VDDIOR) U1.78(VDDIOR) U1.83(VDDIOR) U1.92(VDDIOR) U1.105(OTP_VCC) U1.110(VDDIOT) U1.111(VDDIOT) U4.5(VCC) U5.6(VCC) U6.8(DCVDD) U6.10(DBVDD) U8.5(VCC) U9.8(VCC) U10.8(VCC) U11.8(VCC) U12.8(VCC) X1.1(ENABLE) X1.4(VDD) X2.1(ENABLE) X2.4(VDD)
TCK: TCK.T U1.128(TCK)
TDI: TDI.T U1.2(TDI)
TDO: TDO.T U1.1(TDO)
TMS: TMS.T U1.127(TMS)
USBDM: J2.15 J5.16 R9.1
USBDP: J2.13 J5.14 R8.1
VDD_5V: C3.2 C6.2 C7.2 C10.2 C11.2 C12.2 C13.2 C14.2 C15.2 C16.2 C17.2 C19.2 C21.2 C22.2 C53.2 C54.2 C62.2 C69.2 C72.2 C73.2 C74.2 C75.2 C76.2 C100.1 GND1.T J1.1(VCC) J3.2 J6.1 R35.2 R43.1 SK0.4(VDD) SK1.4(VDD) SK2.4(VDD) SK3.4(VDD) SK4.4(VDD) SK5.4(VDD) SK6.4(VDD) SK7.4(VDD) SK8.4(VDD) SK9.4(VDD) SK10.4(VDD) SK11.4(VDD) U1.45(USB_VBUS) U2.5(EN) U2.7(AVIN) U2.8(PVIN) U3.7(AVIN) U3.8(PVIN) U6.21(SPKVDD2) U6.26(SPKVDD1) U7.3(VIN) U13.5(VCC)
VMID: C4.2 C102.1 TP14.T U6.27(VMID)
XL_DN0: U1.9(X0D41) XL_DN0.T
XL_DN1: U1.8(X0D40) XL_DN1.T
XL_UP0: R12.2 XL_UP0.T
XL_UP1: R14.2 XL_UP1.T
XSYS_RST_N: J7.1 R2.1 RST_N.T U4.1(B)
XUSBDM_N: R9.2 R38.1 U1.47(USB_DM)
XUSBDP_P: R4.1 R8.2 U1.46(USB_DP)
Unconnected: J9.7 J9.8 SK11.1(DOUT) SW1.10(R1) SW1.12(L1) U1.3(X0D36) U1.4(X0D37) U1.5(X0D38) U1.7(X0D39) U1.13(X1D35) U1.22(X1D16) U1.23(X1D17) U1.25(X1D18) U1.26(X1D19) U1.28(X0D10) U1.31(X0D04) U1.33(X0D05) U1.34(X0D06) U1.35(X0D07) U1.37(X0D02) U1.38(X0D03) U1.39(X0D08) U1.40(X0D09) U1.43(USB_ID) U1.50(NC) U1.51(X1D14) U1.53(X1D15) U1.54(X1D20) U1.55(X1D21) U1.61(X0D21) U1.64(X0D22) U1.65(NC) U1.66(X0D23) U1.72(X1D02) U1.74(X1D03) U1.75(X1D04) U1.76(X1D05) U1.77(X1D06) U1.79(X1D07) U1.82(X1D08) U1.84(X1D09) U1.85(X1D00) U1.86(X1D01) U1.90(X0D34) U1.91(X0D35) U1.93(X0D26) U1.94(X0D27) U1.95(X0D32) U1.96(X0D28) U1.97(X0D33) U1.98(X0D29) U1.99(X0D30) U1.100(X0D31) U1.106(X1D40) U1.107(X1D41) U1.108(X1D42) U1.109(X1D43) U1.114(X1D28) U1.115(X1D29) U1.116(X1D30) U1.117(X1D31) U1.118(X1D32) U1.119(X1D33) U1.121(X1D10) U1.122(X1D11) U6.1(MICBIAS) U6.2(LINPUT3/JD2) U6.3(LINPUT2) U6.4(LINPUT1) U6.5(RINPUT1) U6.6(RINPUT2) U6.7(RINPUT3/JD3) U6.16(ADCDAT) U6.23(SPK_LN) U6.25(SPK_LP) U6.30(OUT3) U10.2(3Y) U11.2(3Y) U12.5(2Y)

## Notes on the sheet
- Power/Interface
- v1.0 | Inital release | fuhua.chen
- 2A
- sel aux output channel. default:low
  high - mic array
  low - core
- For vad state output
  high - vad in voice
  low - vad idle
- 1A
- Interface
- POWER
- fuhua.chen | fuhua.chen
- TP/DEBUG
- USB
- v1.0 | v1.0
- xCore | xCore Peripheral / Power Up Control
- for EMC
- And Gate
- Close to Microphone
- fuhua.chen | fuhua.chen
- Close to Microphone
- v1.0 | v1.0
- Clock Sync | Microphone Array & LED Array
- same length
- TOP_MIC | MIC_DATA should have a same length
- same length
- same length
- Synchronized Clock | And Gate
- Max 3.24MHz
- Place on center
- Microphone Clock Contrl
- fuhua.chen | fuhua.chen
- v1.0 | v1.0
- 200MA
- fuhua.chen
- v1.0

## Library data of the parts
1V 3V3 24M 24M_1 ADM_VIN DM DP GND GND1 MIC_CLK0 MIC_CLK1-MIC_CLK6 PG PMCK POR RST RST_N TCK TDI TDO TMS TP4 TP14 XL_DN0 XL_DN1 XL_UP0 XL_UP1 = Discrete-new:TEST-POINT; PARTNO: DNP
C1-C115 = Discrete-new:CAP: Ceramic Capacitors
D1 D2 D7 D8 = Discrete-new:D-ESD-2P: SOD-923:304060009;SOD-123:304060001
D9 D11 = Discrete-new:LED
FR1-FR5 FR7 FR8 = moudle-new:SEEEDSTUDIO-OPEN-SCH-FRAME
J1 = Connector-new:MICRO-USB5+4P: 5+4P-SMD-0.65-B:320010000;5+2P-SMD-0.65-AB:340032001
J2 J3 J5 J6 = Connector-new:HEADER-2X8P
J4 J7 = Connector-new:HEADER-1P
J9 = Connector-new:AUDIO-JACK-8P-SMD: 320040009
J10 = Connector-new:HEADER-2P
L1 L2 = Discrete-new:L
L3-L7 = Discrete-new:INDUCTOR/FERRITE-BEAD
MIC7-MIC13 = Discrete-new:MICROPHONE-MP34DT01
Q1 = Discrete-new:MOSFET-N+: IRLL014: http://www.vishay.com/docs/91319/sihll014.pdf
R1-R25 R27 R32-R41 R43-R50 R58 R60-R65 = Discrete-new:RES
R26 R28-R31 R42 R52 R53 = C-R-package test:RES
SK0 SK1-SK11 = Discrete-new:LED-RGB-4P: 304990003
SW1 = template:SWITCH-ANALOG-FSA2275
U1 = IC-new:MCU-XUF216-512-TQ128
U2 U3 = IC-new:CONVERTER-ETA3410: 3MHZ 2A High Step-Down Converter in DFN2x2-8L Package
U4 U13 = IC-new:LOGIC-74HC1G08: 2-input AND gate
U5 = IC-new:ANALOG-DEVICE-ADM1085
U6 = IC-new:AMPLIFIER-WM8960
U7 = IC-new:PMIC-XC6206P: LOW ESR Cap.Compatible Positive Voltage Regulators
U8 = IC-new:LOGIC-74AHC/T1G79
U9-U12 = IC-new:LOGIC-NC7NZ34
X1 X2 = Discrete-new:CRYSTAL-OSCILLATOR

## Net classes
0 default: width 0.025 mm, drill 0.203 mm, clearance 0.102 mm